# Altium schematic sheet Front End.SchDoc
size 406 x 304 mm; SheetNumber: 4; SheetTotal: 6
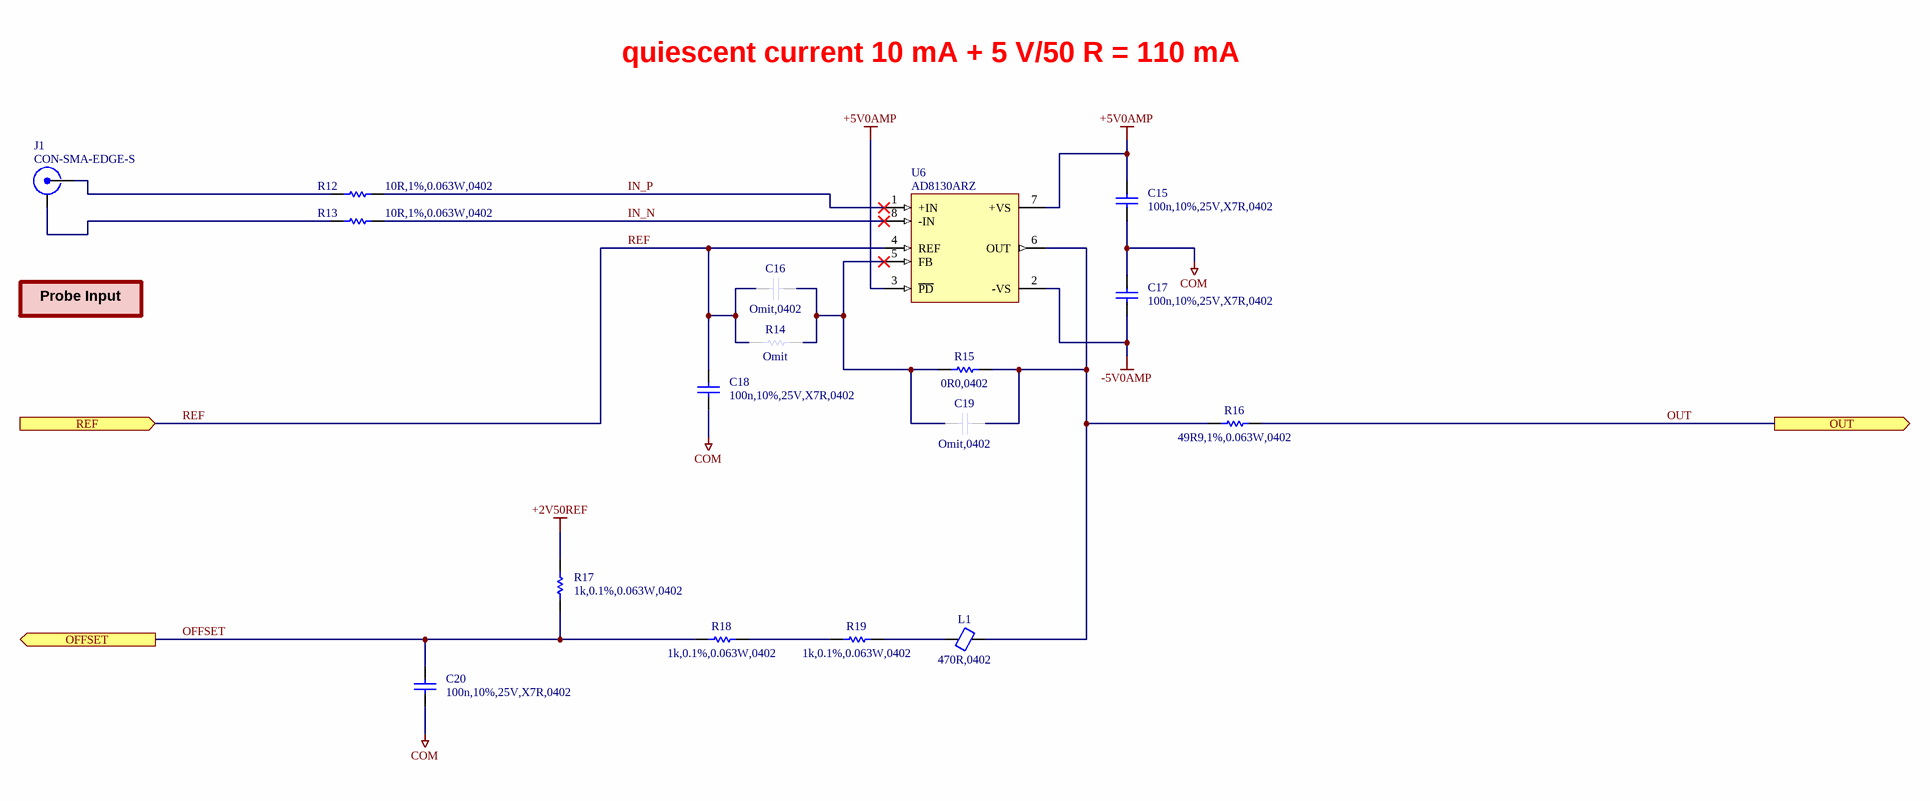
[diagram p0: Front End.SchDoc]

## Parts
C15  100n,10%,25V,X7R,0402  [CAPC1005X06N]
C16  Omit,0402  [CAPC1005X06N]  (no BOM)
C17  100n,10%,25V,X7R,0402  [CAPC1005X06N]
C18  100n,10%,25V,X7R,0402  [CAPC1005X06N]
C19  Omit,0402  [CAPC1005X06N]  (no BOM)
C20  100n,10%,25V,X7R,0402  [CAPC1005X06N]
J1  CON-SMA-EDGE-S  [RFSOLUTIONS_CON-SMA-EDGE-S]
L1  470R,0402  [INDC1005X05N]
R12  10R,1%,0.063W,0402  [RESC1005X04N]
R13  10R,1%,0.063W,0402  [RESC1005X04N]
R14  Omit  [RESC1005X04N]  (no BOM)
R15  0R0,0402  [RESC1005X04N]
R16  49R9,1%,0.063W,0402  [RESC1005X04N]
R17  1k,0.1%,0.063W,0402  [RESC1005X04N]
R18  1k,0.1%,0.063W,0402  [RESC1005X04N]
R19  1k,0.1%,0.063W,0402  [RESC1005X04N]
U6  AD8130ARZ  [ANALOGDEVICES_PKG_R-8]

## Ports
OFFSET (out), OUT (out), REF (in)

## Nets
+2V50REF: R17.2
+5V0AMP: C15.2 U6.3(~{PD}) U6.7(+VS)
-5V0AMP: C17.1 U6.2(-VS)
COM: C15.1 C17.2 C18.1 C20.1
IN_N: R13.2 U6.8(-IN)
IN_P: R12.2 U6.1(+IN)
OFFSET: C20.2 R17.1 R18.1 ; port OFFSET
OUT: R16.2 ; port OUT
REF: C16.1 C18.2 R14.1 U6.4(REF) ; port REF
NetC16_2: C16.2 C19.1 R14.2 R15.1 U6.5(FB)
NetC19_2: C19.2 L1.2 R15.2 R16.1 U6.6(OUT)
NetJ1_1: J1.1(RF) R12.1
NetJ1_2: J1.2(GND) R13.1
NetL1_1: L1.1 R19.2
NetR18_2: R18.2 R19.1

## Notes on the sheet
- quiescent current 10 mA + 5 V/50 R = 110 mA
- Probe Input
- Rev
- Sheet Name:
- Date:
- Sheet
- Designer:
- of

## Library data of the parts
C15 C17 C18 C20 = CAP,Cer,100nF,10%,25V,X7R,0402: 0.1ï¿½F ï¿½10% 25V Ceramic Capacitor X7R 0402 (1005 Metric); Manufacturer 1: Murata Electronics; Manufacturer 1 Part Number: GRM155R71E104KE14J; Vendor 1 Part Number: 490-14603-1-ND; Vendor 1: DigiKey; Value: 100nF; Part Name: CAP,Cer,100nF,10%,25V,X7R,0402; CreatedBy: Judd Foster; HelpURL: https://search.murata.co.jp/Ceramy/image/img/A01X/G101/ENG/GRM155R71E104KE14-01.pdf
C16 C19 = CAP,Omit,0402: Omit; Part Name: CAP,Omit,0402; CreatedBy: Judd Foster; HelpURL: N/A; Manufacturer 1: N/A; Manufacturer 1 Part Number: N/A; Vendor 1: N/A; Vendor 1 Part Number: N/A; Value: Omit
J1 = Conn,RF,SMA,Fem,50R,Edge,SMD: SMA Connector Jack, Female Socket Board Edge, End Launch Solder; Manufacturer 1: RF Solutions; Vendor 1 Part Number: CON-SMA-EDGE-S-ND; Vendor 1: DigiKey; Part Name: Conn,RF,SMA,Fem,50R,Edge,SMD; CreatedBy: Judd Foster; HelpURL: https://www.rfsolutions.co.uk/content/download-files/CON-SMA-EDGE-6-DATASHEET.pdf; Manufacturer 1 Part Number: CON-SMA-EDGE-S
L1 = Ferrite,470R@100MHz,0402: 470 Ohms @ 100 MHz 1 Power Line Ferrite Bead 0402 (1005 Metric) 1A 200mOhm; Manufacturer 1: Murata Electronics; Manufacturer 1 Part Number: BLM15PX471SN1D; Vendor 1 Part Number: 490-10662-1-ND; Vendor 1: Digikey; Value: 470; Part Name: Ferrite,470R@100MHz,0402; CreatedBy: Judd Foster; HelpURL: https://www.murata.com/en-us/products/productdata/8796740059166/ENFA0018.pdf
R12 R13 = RES,10R,1%,0.063W,0402: 10 Ohms ï¿½1% 0.063W, 1/16W Chip Resistor 0402 (1005 Metric) Automotive AEC-Q200 Thick Film; Manufacturer 1: Panasonic Electronic Components; Manufacturer 1 Part Number: ERJ-2RKF10R0X; Vendor 1 Part Number: P10.0LCT-ND; Vendor 1: Digikey; Part Name: RES,10R,1%,0.063W,0402; CreatedBy: Judd Foster; HelpURL: https://industrial.panasonic.com/cdbs/www-data/pdf/RDA0000/AOA0000C304.pdf; Value: 10R
R14 = RES,Omit,0402: Part Name: RES,Omit,0402; CreatedBy: Judd Foster; HelpURL: N/A; Manufacturer 1: N/A; Manufacturer 1 Part Number: N/A; Vendor 1: N/A; Vendor 1 Part Number: N/A; Value: Omit
R15 = RES,0R0,0402: 0 Ohms Jumper 0.1W, 1/10W Chip Resistor 0402 (1005 Metric) Automotive AEC-Q200 Thick Film; Manufacturer 1: Panasonic Electronic Components; Manufacturer 1 Part Number: ERJ-2GE0R00X; Vendor 1 Part Number: P0.0JCT-ND; Vendor 1: Digikey; Value: 0; Part Name: RES,0R0,0402; CreatedBy: Judd Foster; HelpURL: https://industrial.panasonic.com/cdbs/www-data/pdf/RDA0000/AOA0000C301.pdf
R16 = RES,49R9,1%,0.063W,0402: 49.9 Ohms Â±1% 0.063W, 1/16W Chip Resistor 0402 (1005 Metric) Moisture Resistant Thick Film; Manufacturer 1: YAGEO; Manufacturer 1 Part Number: RC0402FR-0749R9L; Vendor 1 Part Number: 311-49.9LRCT-ND; Vendor 1: DigiKey; Part Name: RES,49R9,1%,0.063W,0402; CreatedBy: Judd Foster; HelpURL: https://www.yageo.com/upload/media/product/products/datasheet/rchip/PYu-RC_Group_51_RoHS_L_12.pdf; Value: 49R9
R17-R19 = RES,1k,0.1%,0.063W,0402: 1 kOhms Â±0.1% 0.063W, 1/16W Chip Resistor 0402 (1005 Metric) Thin Film; Manufacturer 1: YAGEO; Manufacturer 1 Part Number: RT0402BRE071KL; Vendor 1 Part Number: YAG2306CT-ND; Vendor 1: DigiKey; Part Name: RES,1k,0.1%,0.063W,0402; CreatedBy: Judd Foster; HelpURL: https://www.yageo.com/upload/media/product/app/datasheet/rchip/pyu-rt_1-to-0.01_rohs_l.pdf; Value: 1k
U6 = AD8130ARZ: Differential Amplifier 1 Circuit 8-SOIC; Manufacturer 1: Analog Devices; Vendor 1 Part Number: 505-AD8130ARZ-ND; Vendor 1: DigiKey; Part Name: AD8130ARZ; CreatedBy: Judd Foster; HelpURL: https://www.analog.com/media/en/technical-documentation/data-sheets/AD8129_8130.pdf; Manufacturer 1 Part Number: AD8130ARZ